# EAGLE schematic NSL_CylonIII (EAGLE 5.11)

## Sheet 1 of 3
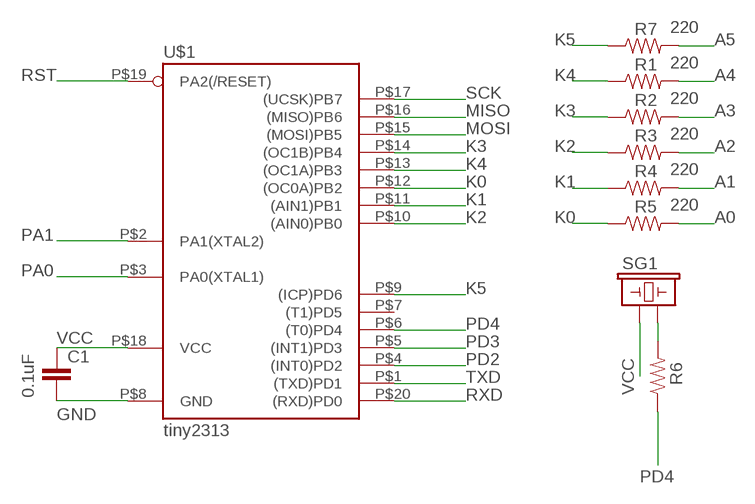
[diagram p0: schematic, sheet 1]

### Parts
C1  0.1uF  CAP0603-CAP  [0603-CAP]
R1  220  RESISTOR  [0805]
R2  220  RESISTOR  [0805]
R3  220  RESISTOR  [0805]
R4  220  RESISTOR  [0805]
R5  220  RESISTOR  [0805]
R6  RESISTOR1206  [1206]
R7  220  RESISTOR  [0805]
SG1  BUZZERSMD2  [BUZZER-CCV]
U$1  tiny2313  TINY2313-*M*  [MLF20]

### Nets
A0 [LED]: R5.2 ; also sheet 3
A1: R4.2 ; also sheet 3
A2: R3.2 ; also sheet 3
A3: R2.2 ; also sheet 3
A4: R1.2 ; also sheet 3
A5: R7.2 ; also sheet 3
GND: C1.2 U$1.P$8(GND) ; also sheet 2
K0 [LED]: R5.1 U$1.P$12((OC0A)PB2)
K1 [LED]: R4.1 U$1.P$11((AIN1)PB1)
K2 [LED]: R3.1 U$1.P$10((AIN0)PB0)
K3 [LED]: R2.1 U$1.P$14((OC1B)PB4)
K4 [LED]: R1.1 U$1.P$13((OC1A)PB3)
K5: R7.1 U$1.P$9((ICP)PD6)
MISO: U$1.P$16((MISO)PB6) ; also sheet 2
MOSI: U$1.P$15((MOSI)PB5) ; also sheet 2
N$4: R6.2 SG1.-
PA0: U$1.P$3(PA0(XTAL1))
PA1: U$1.P$2(PA1(XTAL2))
PD2: U$1.P$4((INT0)PD2) ; also sheet 2
PD3: U$1.P$5((INT1)PD3)
PD4: R6.1 U$1.P$6((T0)PD4)
RST: U$1.P$19(PA2(/RESET)) ; also sheet 2
RXD: U$1.P$20((RXD)PD0)
SCK: U$1.P$17((UCSK)PB7) ; also sheet 2
TXD: U$1.P$1((TXD)PD1)
VCC: C1.1 SG1.+ U$1.P$18(VCC) ; also sheet 2
Unconnected: U$1.P$7((T1)PD5)

## Sheet 2 of 3
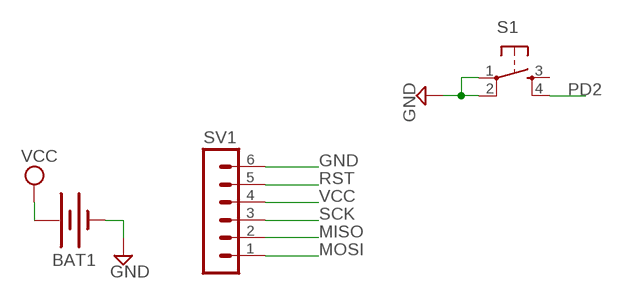
[diagram p1: schematic, sheet 2]

### Parts
BAT1  SPARKFUN_BATTERY20SMD  [SPARKFUN_BATTCON_20MM]
S1  TAC_SWITCHSMD  [TACTILE_SWITCH_SMD]
SV1  MA06-1  [MA06-1]

### Nets
GND: BAT1.2(-) S1.1 S1.2 SV1.6 ; also sheet 1
MISO: SV1.2 ; also sheet 1
MOSI: SV1.1 ; also sheet 1
PD2: S1.4 ; also sheet 1
RST: SV1.5 ; also sheet 1
SCK: SV1.3 ; also sheet 1
VCC: BAT1.1(+) SV1.4 ; also sheet 1
Unconnected: S1.3

## Sheet 3 of 3
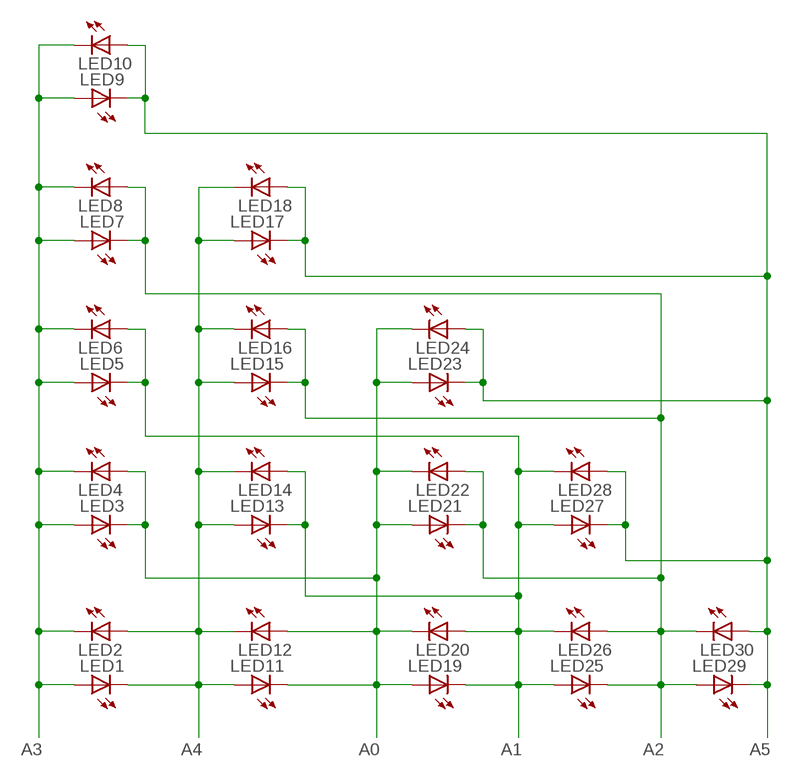
[diagram p2: schematic, sheet 3]

### Parts
LED1  LEDCHIPLED_1206  [CHIPLED_1206]
LED2  LEDCHIPLED_1206  [CHIPLED_1206]
LED3  LEDCHIPLED_1206  [CHIPLED_1206]
LED4  LEDCHIPLED_1206  [CHIPLED_1206]
LED5  LEDCHIPLED_1206  [CHIPLED_1206]
LED6  LEDCHIPLED_1206  [CHIPLED_1206]
LED7  LEDCHIPLED_1206  [CHIPLED_1206]
LED8  LEDCHIPLED_1206  [CHIPLED_1206]
LED9  LEDCHIPLED_1206  [CHIPLED_1206]
LED10  LEDCHIPLED_1206  [CHIPLED_1206]
LED11  LEDCHIPLED_1206  [CHIPLED_1206]
LED12  LEDCHIPLED_1206  [CHIPLED_1206]
LED13  LEDCHIPLED_1206  [CHIPLED_1206]
LED14  LEDCHIPLED_1206  [CHIPLED_1206]
LED15  LEDCHIPLED_1206  [CHIPLED_1206]
LED16  LEDCHIPLED_1206  [CHIPLED_1206]
LED17  LEDCHIPLED_1206  [CHIPLED_1206]
LED18  LEDCHIPLED_1206  [CHIPLED_1206]
LED19  LEDCHIPLED_1206  [CHIPLED_1206]
LED20  LEDCHIPLED_1206  [CHIPLED_1206]
LED21  LEDCHIPLED_1206  [CHIPLED_1206]
LED22  LEDCHIPLED_1206  [CHIPLED_1206]
LED23  LEDCHIPLED_1206  [CHIPLED_1206]
LED24  LEDCHIPLED_1206  [CHIPLED_1206]
LED25  LEDCHIPLED_1206  [CHIPLED_1206]
LED26  LEDCHIPLED_1206  [CHIPLED_1206]
LED27  LEDCHIPLED_1206  [CHIPLED_1206]
LED28  LEDCHIPLED_1206  [CHIPLED_1206]
LED29  LEDCHIPLED_1206  [CHIPLED_1206]
LED30  LEDCHIPLED_1206  [CHIPLED_1206]

### Nets
A0 [LED]: LED3.C LED4.A LED11.C LED12.A LED19.A LED20.C LED21.A LED22.C LED23.A LED24.C ; also sheet 1
A1: LED5.C LED6.A LED13.C LED14.A LED19.C LED20.A LED25.A LED26.C LED27.A LED28.C ; also sheet 1
A2: LED7.C LED8.A LED15.C LED16.A LED21.C LED22.A LED25.C LED26.A LED29.A LED30.C ; also sheet 1
A3: LED1.A LED2.C LED3.A LED4.C LED5.A LED6.C LED7.A LED8.C LED9.A LED10.C ; also sheet 1
A4: LED1.C LED2.A LED11.A LED12.C LED13.A LED14.C LED15.A LED16.C LED17.A LED18.C ; also sheet 1
A5: LED9.C LED10.A LED17.C LED18.A LED23.C LED24.A LED27.C LED28.A LED29.C LED30.A ; also sheet 1

## Library data of the parts
BAT1 = NSL:SPARKFUN_BATTERY: Battery Holders Various common sizes : AA, AAA, 20mm coin cell and 12mm coin cell.
C1 = SparkFun:CAP: Capacitor Standard 0603 ceramic capacitor, and 0.1" leaded capacitor.
LED1-LED30 = led:LED: LED OSRAM: - CHIPLED LG R971, LG N971, LY N971, LG Q971, LY Q971, LO R971, LY R971 LH N974, LH R974 LS Q976, LO Q976, LY Q976 LO Q996 - Hyper CHIPLED LW Q18S LB Q993, LB Q99A, LB R99A - SideLED LS A670, LO A670, LY A670, LG A670, LP A670 LB A673, LV A673, LT A673, LW A673 LH A674 LY A675 LS A676, LA A676, LO A676, LY A676, LW A676 LS A679, LY A679, LG A679 - Hyper Micro SIDELED® LS Y876, LA Y876, LO Y876, LY Y876 LT Y87S - SmartLED LW L88C, LW L88S LB L89C, LB L89S, LG L890 LS L89K, LO L89K, LY L89K LS L896, LA L896, LO L896, LY L896 - TOPLED LS T670, LO T670, LY T670, LG T670, LP T670 LSG T670, LSP T670, LSY T670, LOP T670, LYG T670 LG T671, LOG T671, LSG T671 LB T673, LV T673, LT T673, LW T673 LH T674 LS T676, LA T676, LO T676, LY T676, LB T676, LH T676, LSB T676, LW T676 LB T67C, LV T67C, LT T67C, LS T67K, LO T67K, LY T67K, LW E67C LS E67B, LA E67B, LO E67B, LY E67B, LB E67C, LV E67C, LT E67C LW T67C LS T679, LY T679, LG T679 LS T770, LO T770, LY T770, LG T770, LP T770 LB T773, LV T773, LT T773, LW T773 LH T774 LS E675, LA E675, LY E675, LS T675 LS T776, LA T776, LO T776, LY T776, LB T776 LHGB T686 LT T68C, LB T68C - Hyper Mini TOPLED® LB M676 - Mini TOPLED Santana® LG M470 LS M47K, LO M47K, LY M47K Source: http://www.osram.convergy.de LUXEON: - LUMILED® LXK2-PW12-R00, LXK2-PW12-S00, LXK2-PW14-U00, LXK2-PW14-V00 LXK2-PM12-R00, LXK2-PM12-S00, LXK2-PM14-U00 LXK2-PE12-Q00, LXK2-PE12-R00, LXK2-PE12-S00, LXK2-PE14-T00, LXK2-PE14-U00 LXK2-PB12-K00, LXK2-PB12-L00, LXK2-PB12-M00, LXK2-PB14-N00, LXK2-PB14-P00, LXK2-PB14-Q00 LXK2-PR12-L00, LXK2-PR12-M00, LXK2-PR14-Q00, LXK2-PR14-R00 LXK2-PD12-Q00, LXK2-PD12-R00, LXK2-PD12-S00 LXK2-PH12-R00, LXK2-PH12-S00 LXK2-PL12-P00, LXK2-PL12-Q00, LXK2-PL12-R00 Source: www.luxeon.com KINGBRIGHT: KA-3528ASYC Source: www.kingbright.com
R1-R5 R7 = NSL:RESISTOR: Resistor Basic schematic elements and footprints for 0603, 1206, and PTH 1/10th watt (small) resistors.
R6 = SparkFun:RESISTOR: Resistor Basic schematic elements and footprints for 0603, 1206, and PTH 1/10th watt (small) resistors.
S1 = SparkFun:TAC_SWITCH: Momentary Switch Button commonly used for reset or general input. Spark Fun Electronics SKU : COM-00097
SG1 = SparkFun:BUZZER: Buzzer 12mm Spark Fun Electronics SKU : Comp-Buzzer
SV1 = NSL:MA06-1: PIN HEADER
U$1 = NSL_Cylon:TINY2313*: Atmel Tiny2313 2K Flash, 128 bytes EEPROM, 128 bytes RAM

## Net classes
0 default: width 0.254 mm
1 LED: width 0.203 mm